# EAGLE schematic charlie heart (EAGLE 6.5.0)
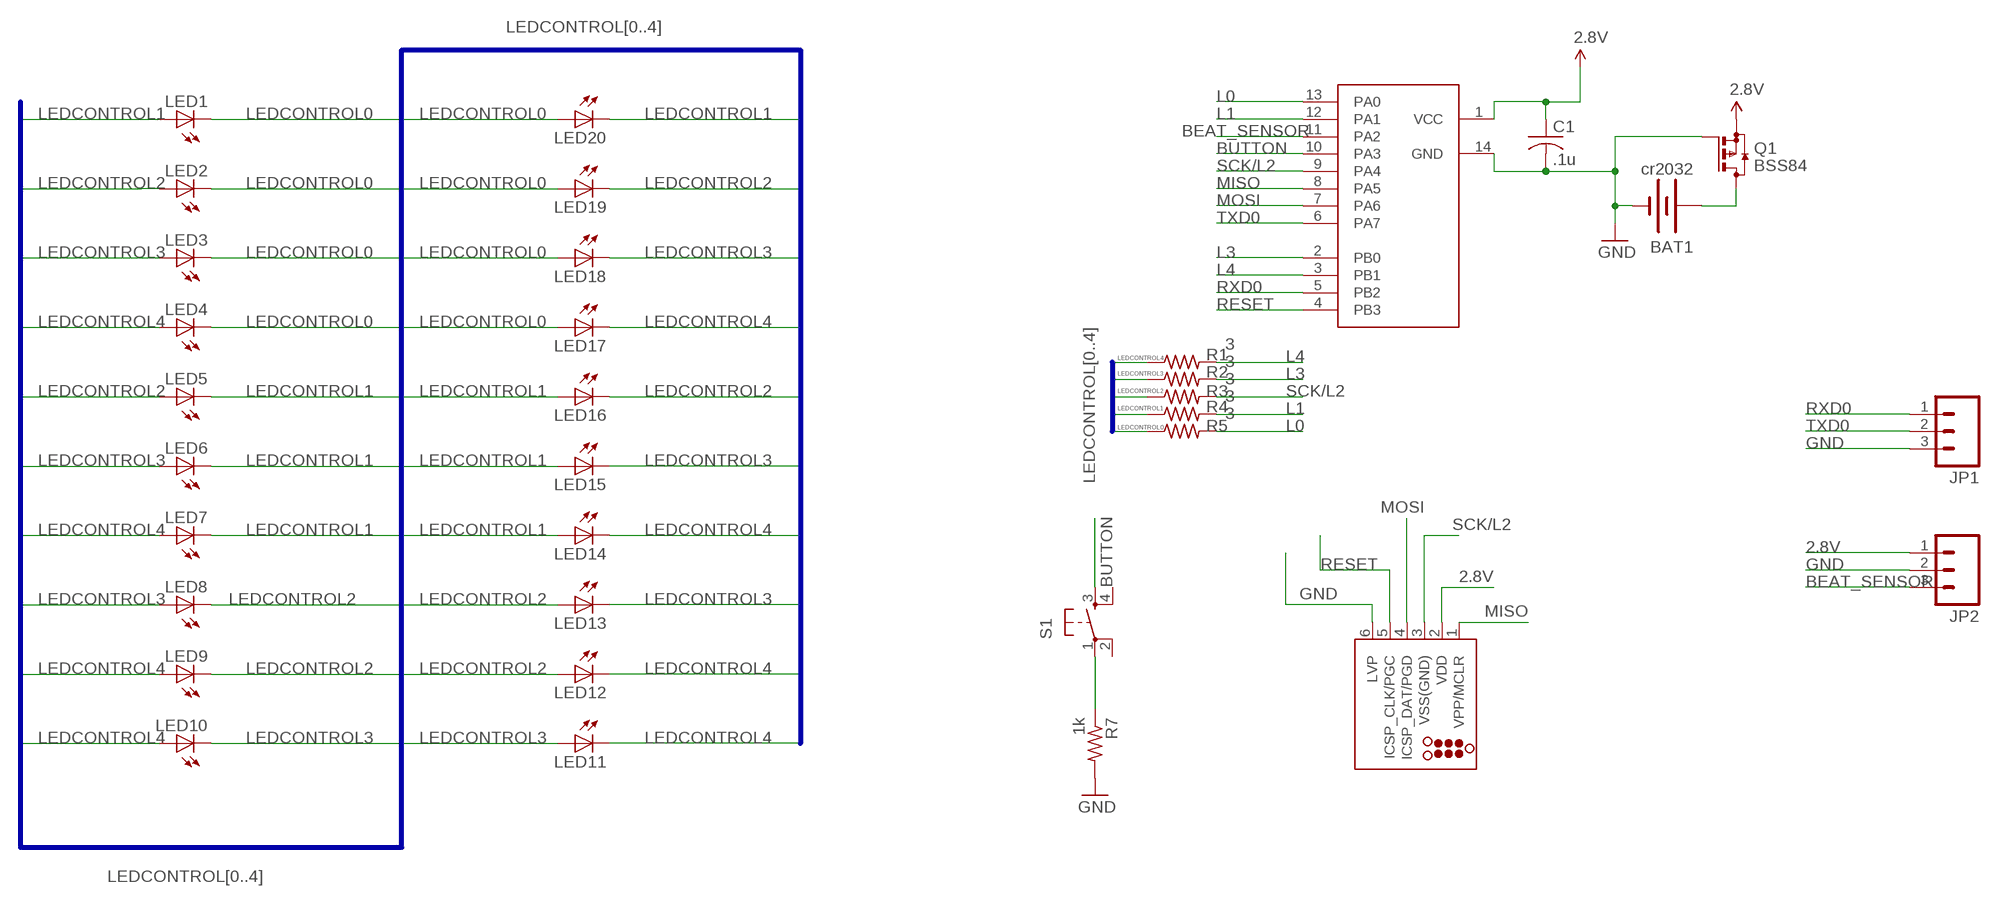
[diagram p0: schematic, sheet 1]

## Parts
BAT1  cr2032  BATTERY20SMD  [BATTCON_20MM]
C1  .1u  C-USC1206  [C1206]
J1  TC2030-MCP-NL  [TC2030-MCP-NL]
JP1  M031X03_NO_SILK  [1X03_NO_SILK]
JP2  M031X03_NO_SILK  [1X03_NO_SILK]
LED1  LEDCHIP-LED0805  [CHIP-LED0805]
LED2  LEDCHIP-LED0805  [CHIP-LED0805]
LED3  LEDCHIP-LED0805  [CHIP-LED0805]
LED4  LEDCHIP-LED0805  [CHIP-LED0805]
LED5  LEDCHIP-LED0805  [CHIP-LED0805]
LED6  LEDCHIP-LED0805  [CHIP-LED0805]
LED7  LEDCHIP-LED0805  [CHIP-LED0805]
LED8  LEDCHIP-LED0805  [CHIP-LED0805]
LED9  LEDCHIP-LED0805  [CHIP-LED0805]
LED10  LEDCHIP-LED0805  [CHIP-LED0805]
LED11  LEDCHIP-LED0805  [CHIP-LED0805]
LED12  LEDCHIP-LED0805  [CHIP-LED0805]
LED13  LEDCHIP-LED0805  [CHIP-LED0805]
LED14  LEDCHIP-LED0805  [CHIP-LED0805]
LED15  LEDCHIP-LED0805  [CHIP-LED0805]
LED16  LEDCHIP-LED0805  [CHIP-LED0805]
LED17  LEDCHIP-LED0805  [CHIP-LED0805]
LED18  LEDCHIP-LED0805  [CHIP-LED0805]
LED19  LEDCHIP-LED0805  [CHIP-LED0805]
LED20  LEDCHIP-LED0805  [CHIP-LED0805]
Q1  BSS84  [SOT23]
R1  3  R-US_R0805  [R0805]
R2  3  R-US_R0805  [R0805]
R3  3  R-US_R0805  [R0805]
R4  3  R-US_R0805  [R0805]
R5  3  R-US_R0805  [R0805]
R7  1k  R-US_R0805  [R0805]
S1  TAC_SWITCHSMD  [TACTILE_SWITCH_SMD]
U1  ATTINY841  ATTINY841-SSU  [SOIC127P600X175-14N]

## Nets
2.8V [power]: C1.1 J1.2(VDD) JP2.1 Q1.2(S) U1.1(VCC)
BEAT_SENSOR: JP2.3 U1.11(PA2)
BUTTON: S1.3 U1.10(PA3)
GND [power]: BAT1.2(-) C1.2 J1.6(LVP) JP1.3 JP2.2 Q1.1(G) R7.2 U1.14(GND)
L0: R5.2 U1.13(PA0)
L1: R4.2 U1.12(PA1)
L3: R2.2 U1.2(PB0)
L4: R1.2 U1.3(PB1)
LEDCONTROL0: LED1.C LED2.C LED3.C LED4.C LED17.A LED18.A LED19.A LED20.A R5.1
LEDCONTROL1: LED1.A LED5.C LED6.C LED7.C LED14.A LED15.A LED16.A LED20.C R4.1
LEDCONTROL2: LED2.A LED5.A LED8.C LED9.C LED12.A LED13.A LED16.C LED19.C R3.1
LEDCONTROL3: LED3.A LED6.A LED8.A LED10.C LED11.A LED13.C LED15.C LED18.C R2.1
LEDCONTROL4: LED4.A LED7.A LED9.A LED10.A LED11.C LED12.C LED14.C LED17.C R1.1
MISO: J1.1(VPP/MCLR) U1.8(PA5)
MOSI: J1.4(ICSP_DAT/PGD) U1.7(PA6)
N$2 [power]: BAT1.1(+) Q1.3(D)
N$3: R7.1 S1.1
RESET: J1.5(ICSP_CLK/PGC) U1.4(PB3)
RXD0: JP1.1 U1.5(PB2)
SCK/L2: J1.3(VSS(GND)) R3.2 U1.9(PA4)
TXD0: JP1.2 U1.6(PA7)
Unconnected: S1.2 S1.4

## Buses
LEDCONTROL[0..4]

## Library data of the parts
BAT1 = SparkFun:BATTERY: Battery Holders Various common sizes : AA, AAA, 20mm coin cell and 12mm coin cell.
C1 = rcl:C-US: CAPACITOR, American symbol
J1 = tag-connect:TC2030: TAG-CONNECT ICSP Connector Manufacturer: Tag-Connect <http://www.tag-connect.com> Cable for easy In-Circuit Serial Programming. Designed for Microchip ICD2, suitable for many others. Two variants - one "with legs" (for hands-free fit on PCB) and another "without legs" for quick programming. PAD Description 1 MCLR/Vpp 2 Vdd 3 GND 4 PGD (ISPDAT) 5 PGC (ISPCLK) 6 nc (used for LVP) ©2009 ROFA.cz - modified and updated by Robert Darlington ‹rdarlington@gmail.com›
JP1 JP2 = SparkFun:M03: Header 3 Standard 3-pin 0.1" header. Use with straight break away headers (SKU : PRT-00116), right angle break away headers (PRT-00553), swiss pins (PRT-00743), machine pins (PRT-00117), and female headers (PRT-00115). Molex polarized connector foot print use with SKU : PRT-08232 with associated crimp pins and housings.
LED1-LED20 = led:LED: LED OSRAM: - CHIPLED LG R971, LG N971, LY N971, LG Q971, LY Q971, LO R971, LY R971 LH N974, LH R974 LS Q976, LO Q976, LY Q976 LO Q996 - Hyper CHIPLED LW Q18S LB Q993, LB Q99A, LB R99A - SideLED LS A670, LO A670, LY A670, LG A670, LP A670 LB A673, LV A673, LT A673, LW A673 LH A674 LY A675 LS A676, LA A676, LO A676, LY A676, LW A676 LS A679, LY A679, LG A679 - Hyper Micro SIDELED® LS Y876, LA Y876, LO Y876, LY Y876 LT Y87S - SmartLED LW L88C, LW L88S LB L89C, LB L89S, LG L890 LS L89K, LO L89K, LY L89K LS L896, LA L896, LO L896, LY L896 - TOPLED LS T670, LO T670, LY T670, LG T670, LP T670 LSG T670, LSP T670, LSY T670, LOP T670, LYG T670 LG T671, LOG T671, LSG T671 LB T673, LV T673, LT T673, LW T673 LH T674 LS T676, LA T676, LO T676, LY T676, LB T676, LH T676, LSB T676, LW T676 LB T67C, LV T67C, LT T67C, LS T67K, LO T67K, LY T67K, LW E67C LS E67B, LA E67B, LO E67B, LY E67B, LB E67C, LV E67C, LT E67C LW T67C LS T679, LY T679, LG T679 LS T770, LO T770, LY T770, LG T770, LP T770 LB T773, LV T773, LT T773, LW T773 LH T774 LS E675, LA E675, LY E675, LS T675 LS T776, LA T776, LO T776, LY T776, LB T776 LHGB T686 LT T68C, LB T68C - Hyper Mini TOPLED® LB M676 - Mini TOPLED Santana® LG M470 LS M47K, LO M47K, LY M47K Source: http://www.osram.convergy.de LUXEON: - LUMILED® LXK2-PW12-R00, LXK2-PW12-S00, LXK2-PW14-U00, LXK2-PW14-V00 LXK2-PM12-R00, LXK2-PM12-S00, LXK2-PM14-U00 LXK2-PE12-Q00, LXK2-PE12-R00, LXK2-PE12-S00, LXK2-PE14-T00, LXK2-PE14-U00 LXK2-PB12-K00, LXK2-PB12-L00, LXK2-PB12-M00, LXK2-PB14-N00, LXK2-PB14-P00, LXK2-PB14-Q00 LXK2-PR12-L00, LXK2-PR12-M00, LXK2-PR14-Q00, LXK2-PR14-R00 LXK2-PD12-Q00, LXK2-PD12-R00, LXK2-PD12-S00 LXK2-PH12-R00, LXK2-PH12-S00 LXK2-PL12-P00, LXK2-PL12-Q00, LXK2-PL12-R00 Source: www.luxeon.com KINGBRIGHT: KA-3528ASYC Source: www.kingbright.com
Q1 = transistor-small-signal:BSS84: P-CHANNEL MOS FET
R1-R5 R7 = rcl:R-US_: RESISTOR, American symbol
S1 = SparkFun:TAC_SWITCH: Momentary Switch Button commonly used for reset or general input. Spark Fun Electronics SKU : COM-00097
U1 = Atmel_By_element14_Batch_1-00:ATTINY841-SSU: 8 bit AVR

## Net classes
1 power: width 0.406 mm, clearance 0.203 mm